# Altium schematic sheet 芯片.SchDoc
size A4
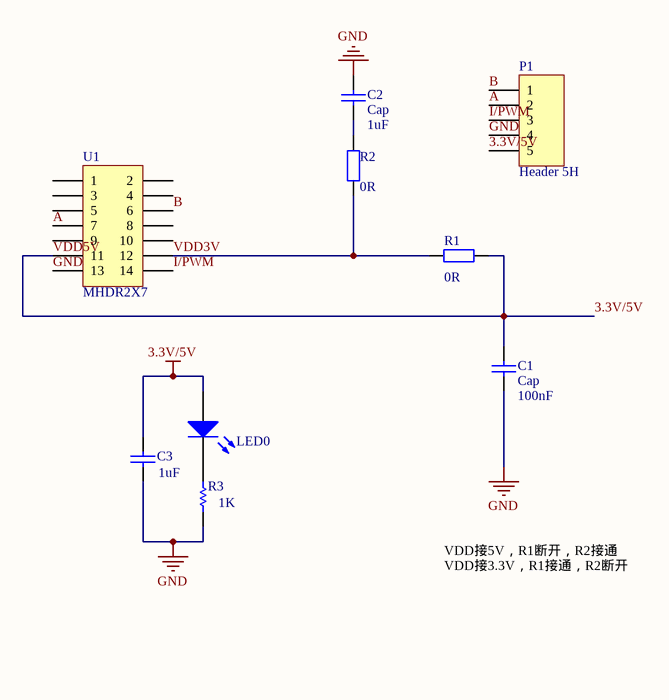
[diagram p0: 芯片.SchDoc]

## Parts
C1  Cap  value 100nF  [0805]
C2  Cap  value 1uF  [0805]
C3  value 1uF  [0805]  (hidden comment: Cap)
D1  LED0  [0805]
P1  Header 5H  [5pin_XH2.54]
R1  value 0R  [0805]  (hidden comment: Res2)
R2  value 0R  [0805]  (hidden comment: Res2)
R3  value 1K  [0805]  (hidden comment: Res1)
U1  MHDR2X7  [SSOP14]

## Nets
3.3V/5V: C1.1 C3.2 D1.1(A) P1.5 R1.2 U1.11  [also labelled VDD5V]
GND: C1.2 C2.1 C3.1 P1.4 R3.1 U1.13
A: P1.2 U1.7
B: P1.1 U1.6
I/PWM: P1.3 U1.14
VDD3V: R1.1 R2.1 U1.12
NetC2_2: C2.2 R2.2
NetD1_2: D1.2(K) R3.2

Not connected (* = marked no-connect by the designer): U1 1 2 3 4 5 8 9 10

## Notes on the sheet
- VDD接5V，R1断开，R2接通
  VDD接3.3V，R1接通，R2断开

## Library data of the parts
C1-C3 = Cap: Capacitor; Published: 8-Jun-2000; LatestRevisionDate: 17-Jul-2002; LatestRevisionNote: Re-released for DXP Platform.; PackageReference: RAD-0.3; Publisher: Altium Limited
  C1 C2: PackageDescription: Radial Cap, Thru-Hole; 2 Leads; 0.3 in Pin Spacing
D1 = LED0: Typical INFRARED GaAs LED; Published: 8-Jun-2000; LatestRevisionDate: 08-Jul-2005; LatestRevisionNote: Mech Layer 1 removed.; PackageReference: LED-0; Publisher: Altium Limited
P1 = Header 5H: Header, 5-Pin, Right Angle; LatestRevisionDate: 17-Jul-2002; LatestRevisionNote: Re-released for DXP Platform.; Publisher: Altium Limited
R1 R2 = Res2: Resistor; Published: 8-Jun-2000; LatestRevisionDate: 17-Jul-2002; LatestRevisionNote: Re-released for DXP Platform.; PackageReference: AXIAL-0.4; Publisher: Altium Limited; PackageDescription: Axial Device, Thru-Hole; 2 Leads; 0.4 in Pin Spacing
R3 = Res1: Resistor; Published: 8-Jun-2000; LatestRevisionDate: 17-Jul-2002; LatestRevisionNote: Re-released for DXP Platform.; PackageReference: AXIAL-0.3; Publisher: Altium Limited
U1 = MHDR2X7: Header, 7-Pin, Dual row; LatestRevisionDate: 17-Jul-2002; LatestRevisionNote: Re-released for DXP Platform.; Publisher: Altium Limited